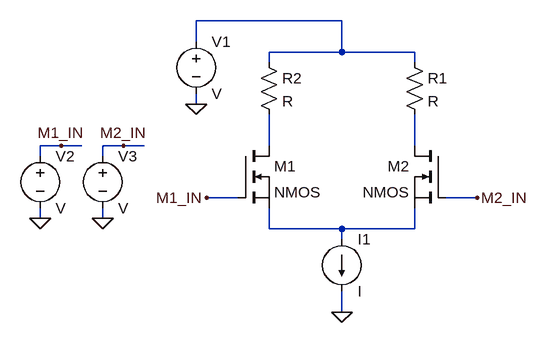
[diagram p0: schematic Draft1.asc]
Draft1.asc, the LTspice schematic file:
Version 4
SHEET 1 880 680
WIRE 80 -32 -144 -32
WIRE -144 0 -144 -32
WIRE 80 16 80 -32
WIRE 80 16 -32 16
WIRE 192 16 80 16
WIRE -32 32 -32 16
WIRE 192 32 192 16
WIRE -144 96 -144 80
WIRE -352 160 -384 160
WIRE -320 160 -352 160
WIRE -256 160 -288 160
WIRE -224 160 -256 160
WIRE -32 160 -32 112
WIRE 192 160 192 112
WIRE -384 176 -384 160
WIRE -288 176 -288 160
WIRE -80 240 -128 240
WIRE 288 240 240 240
WIRE -384 272 -384 256
WIRE -288 272 -288 256
WIRE -32 288 -32 256
WIRE 80 288 -32 288
WIRE 192 288 192 256
WIRE 192 288 80 288
WIRE 80 304 80 288
WIRE 80 416 80 384
FLAG 80 416 0
FLAG -144 96 0
FLAG -384 272 0
FLAG -288 272 0
FLAG -352 160 M1_IN
FLAG -256 160 M2_IN
FLAG -128 240 M1_IN
FLAG 288 240 M2_IN
SYMBOL nmos -80 160 R0
SYMATTR InstName M1
SYMBOL current 80 304 R0
SYMATTR InstName I1
SYMBOL res 176 16 R0
SYMATTR InstName R1
SYMBOL res -48 16 R0
SYMATTR InstName R2
SYMBOL voltage -144 -16 R0
SYMATTR InstName V1
SYMBOL nmos 240 160 M0
SYMATTR InstName M2
SYMBOL voltage -384 160 R0
SYMATTR InstName V2
SYMBOL voltage -288 160 R0
SYMATTR InstName V3

The netlist it stands for:
* Draft1.asc
M1 N002 M1_IN N004 N004 NMOS
I1 N004 0 I
R1 N001 N003 R
R2 N001 N002 R
V1 N001 0 V
M2 N003 M2_IN N004 N004 NMOS
V2 M1_IN 0 V
V3 M2_IN 0 V
.model NMOS NMOS
.model PMOS PMOS
.lib standard.mos
.backanno
.end